# Altium schematic sheet GND_FAULT.SchDoc
size 431 x 279 mm; Organization: ORGANIZATION; Address1: ADDRESS 1; Address2: ADDRESS 2; Address3: ADDRESS 3; Address4: ADDRESS 4; Revision: -; SheetNumber: 12; SheetTotal: 14; ENG_APP_DATE: --/--/--; DSN_APP_DATE: --/--/--; CHK_APP_DATE: --/--/--
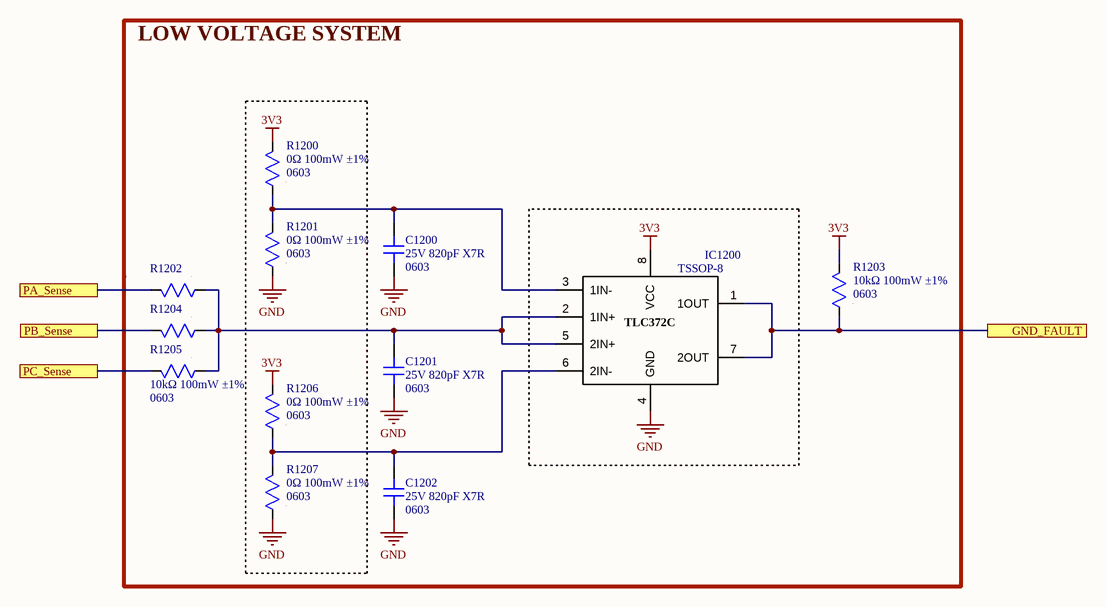
[diagram p0: GND_FAULT.SchDoc]

## Parts
C1200  value 25V 820pF X7R  Package: 0603  [CAP SMD 0603]  (hidden comment: CAP non polarized)
C1201  value 25V 820pF X7R  Package: 0603  [CAP SMD 0603]  (hidden comment: CAP non polarized)
C1202  value 25V 820pF X7R  Package: 0603  [CAP SMD 0603]  (hidden comment: CAP non polarized)
IC1200  TLC372C  [TSSOP-8]  (value not drawn)
R1200  value 0Ω 100mW ±1%  Package: 0603  [RES SMD 0603]  (hidden comment: RES)
R1201  value 0Ω 100mW ±1%  Package: 0603  [RES SMD 0603]  (hidden comment: RES)
R1202  RES  [RES SMD 0603]  (value not drawn)
R1203  value 10kΩ 100mW ±1%  Package: 0603  [RES SMD 0603]  (hidden comment: RES)
R1204  RES  [RES SMD 0603]  (value not drawn)
R1205  value 10kΩ 100mW ±1%  Package: 0603  [RES SMD 0603]  (hidden comment: RES)
R1206  value 0Ω 100mW ±1%  Package: 0603  [RES SMD 0603]  (hidden comment: RES)
R1207  value 0Ω 100mW ±1%  Package: 0603  [RES SMD 0603]  (hidden comment: RES)

## Blocks framed on the sheet
LOW VOLTAGE SYSTEM: C1200-C1202 IC1200 R1200-R1207

## Ports
GND_FAULT, PA_Sense, PB_Sense, PC_Sense

## Nets
3V3: IC1200.8(VCC) R1200.2 R1203.2 R1206.2
GND: C1200.2 C1201.2 C1202.2 IC1200.4(GND) R1201.1 R1207.1
GND_FAULT: IC1200.1(1OUT) IC1200.7(2OUT) R1203.1 ; port GND_FAULT
PA_Sense: R1202.2 ; port PA_Sense
PB_Sense: R1204.2 ; port PB_Sense
PC_Sense: R1205.2 ; port PC_Sense
NetC1200_1: C1200.1 IC1200.3(1IN-) R1200.1 R1201.2
NetC1201_1: C1201.1 IC1200.2(1IN+) IC1200.5(2IN+) R1202.1 R1204.1 R1205.1
NetC1202_1: C1202.1 IC1200.6(2IN-) R1206.1 R1207.2

## Notes on the sheet
- DWG. NO.
- REV.
- SHT.
- THIS DOCUMENT AND THE DATA DISCLOSED HEREIN OR HEREWITH IS THE PROPERTY OF ALTIUM LIMITED AND MAY BE FREELY DISTRIBUTED IN WHOLE. NO RIGHTS ARE RESERVED OR EXPRESS OR IMPLIED WARANTEE GIVEN.
- REVISION
- DESCRIPTION
- DATE
- APPROVED
- ENG:
- APPROVALS
- PROJECT
- DSN:
- CHK:
- REFERENCE DOCUMENTS
- PROJECT REVISION:
- TITLE
- DOCUMENT REVISION:
- DESIGN ITEM:
- BOM:
- FAB DWG:
- PCB DWG:
- ASSY DWG:
- SCALE:
- SIZE
- B
- CAGE CODE
- FILE NAME
- DWG NO.
- SHEET
- OF
- REV

## Library data of the parts
C1200-C1202 = 001-0124: Condensadores de cerámica multicapa (MLCC- SMD/SMT) 25V 820pF X7R 0603 1 0% Tol; MPN: 06033C821KAT2A; Manufacturer: KYOCERA AVX; ComponentLink1Description: Datasheet; ComponentLink1URL: https://www.mouser.es/datasheet/3/5926/1/X7RDielectric.pdf; ComponentLink2Description: Distributor Link; ComponentLink2URL: https://www.mouser.es/ProductDetail/KYOCERA-AVX/06033C821KAT2A?qs=L7ztplQO5PEEKgzJp4fVEA%3D%3D; ID: 001-0124; Distributor PN: 581-06033C821KAT2A; Distributor: Mouser
IC1200 = 050-0005: Comparadores analógicos Dual Differential A 595-TLC372CPW A 595- A 595-TLC372CPW; MPN: TLC372CPWR; Manufacturer: Texas Instruments; ComponentLink1Description: Datasheet; ComponentLink1URL: https://www.ti.com/lit/ds/symlink/tlc372.pdf?ts=1782158413305&ref_url=https%253A%252F%252Fwww.mouser.es%252F; ComponentLink2Description: Distributor Link; ComponentLink2URL: https://www.mouser.es/ProductDetail/Texas-Instruments/TLC372CPWR?qs=Zu35EjizYSQJQcLjIiS2wQ%3D%3D; ID: 050-0005; Value: -; Package: TSSOP-8; Distributor PN: 595-TLC372CPWR; Distributor: Mouser
R1200 R1201 R1206 R1207 = 010-0160: Resistores de película gruesa - SMD WRIS-RSKS <0.05 Ohms 0.1 W Jumper 0603 AEC-Q200; MPN: 560112116001; Manufacturer: Wurth Elektronik; ComponentLink1Description: Datasheet; ComponentLink1URL: https://www.we-online.com/components/products/datasheet/560112116001.pdf; ComponentLink2Description: Distributor Link; ComponentLink2URL: https://www.mouser.es/ProductDetail/Wurth-Elektronik/560112116001?qs=mELouGlnn3dlnHYj7TecuA%3D%3D; ID: 010-0160; Distributor PN: 710-560112116001; Distributor: Mouser
R1202 R1204 = 010-0145: Resistores de película gruesa - SMD WRIS-RSKS 10 kOhms 1 % 0.1 W 0603 AEC-Q200; MPN: 560112116005; Manufacturer: Wurth Elektronik; Value: 10kΩ 100mW ±1%; ComponentLink1Description: Datasheet; ComponentLink1URL: https://www.we-online.com/components/products/datasheet/560112116005.pdf; ComponentLink2Description: Distributor Link; ComponentLink2URL: https://www.mouser.es/ProductDetail/Wurth-Elektronik/560112116005?qs=mELouGlnn3dMVSPHwBGouA%3D%3D; Package: 0603; ID: 010-0145; Distributor PN: 710-560112116005; Distributor: Mouser
R1203 R1205 = 010-0145: Resistores de película gruesa - SMD WRIS-RSKS 10 kOhms 1 % 0.1 W 0603 AEC-Q200; MPN: 560112116005; Manufacturer: Wurth Elektronik; ComponentLink1Description: Datasheet; ComponentLink1URL: https://www.we-online.com/components/products/datasheet/560112116005.pdf; ComponentLink2Description: Distributor Link; ComponentLink2URL: https://www.mouser.es/ProductDetail/Wurth-Elektronik/560112116005?qs=mELouGlnn3dMVSPHwBGouA%3D%3D; ID: 010-0145; Distributor PN: 710-560112116005; Distributor: Mouser